# Altium schematic sheet ESP32+DAC.SchDoc
size 431 x 279 mm; SheetNumber: 3; SheetTotal: 9; ENG_APP_DATE: --/--/--; DSN_APP_DATE: --/--/--; CHK_APP_DATE: --/--/--
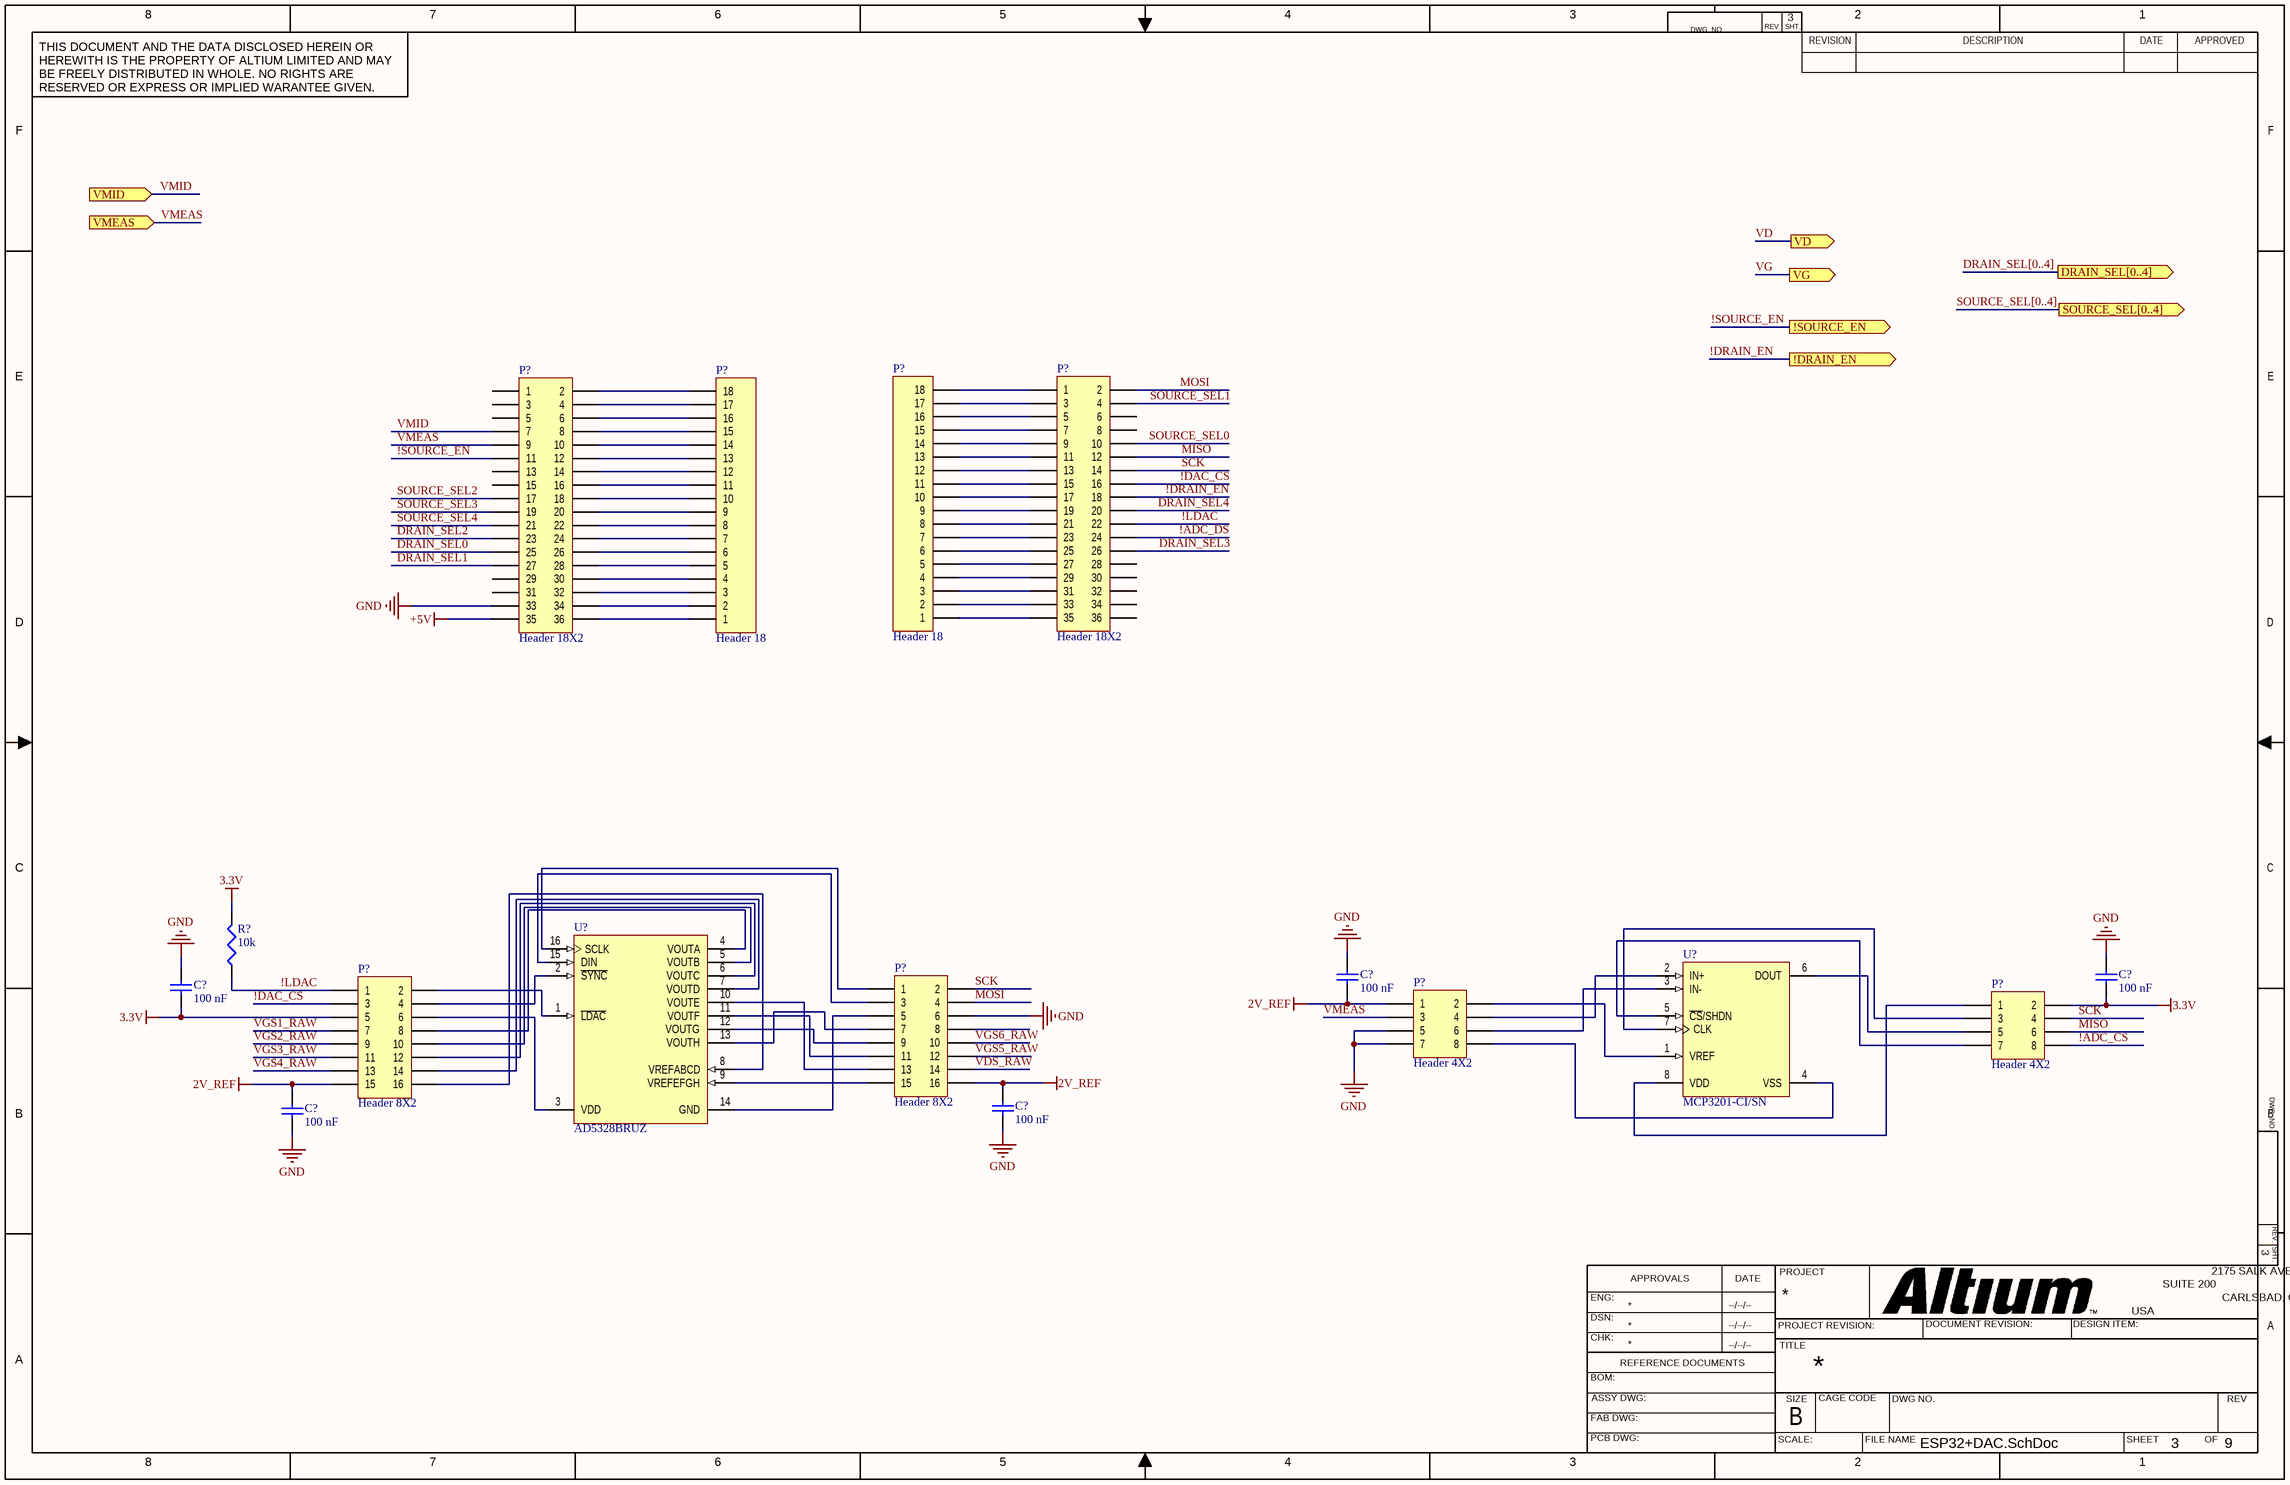
[diagram p0: ESP32+DAC.SchDoc]

## Parts
(Parts that share a designator on the sheet are numbered #1, #2 ... from top to bottom, then left to right.)
C?#1  100 nF  [1608[0603]]
C?#2  100 nF  [1608[0603]]
C?#3  100 nF  [1608[0603]]
C?#4  100 nF  [1608[0603]]
C?#5  100 nF  [1608[0603]]
P?#1  Header 18X2  [HDR2X18]
P?#2  Header 18X2  [HDR2X18]
P?#3  Header 18  [HDR1X18]
P?#4  Header 18  [HDR1X18]
P?#5  Header 8X2  [HDR2X8]
P?#6  Header 8X2  [HDR2X8]
P?#7  Header 4X2  [HDR2X4]
P?#8  Header 4X2  [HDR2X4]
R?  10k  [J1-0603]
U?#1  AD5328BRUZ  [RU-16_L]
U?#2  MCP3201-CI/SN  [SOIC-SN8_L]

## Ports
!DRAIN_EN (out), !SOURCE_EN (out), DRAIN_SEL[0..4] (out), SOURCE_SEL[0..4] (out), VD (out), VG (out), VMEAS (in), VMID (in)

## Nets
2V_REF: C?#1.2 C?#4.2 C?#5.2 P?#5.15 P?#6.16 P?#7.1
3.3V: C?#2.1 C?#3.1 P?#5.5 P?#8.2 R?.2
+5V: P?#2.35
GND: C?#1.1 C?#2.2 C?#3.2 C?#4.1 C?#5.1 P?#2.33 P?#6.6 P?#7.5 P?#7.7
!ADC_CS: P?#8.8
!ADC_DS: P?#1.24
!DAC_CS: P?#1.16 P?#5.3
!DRAIN_EN: P?#1.18 ; port !DRAIN_EN
!LDAC: P?#1.22 P?#5.1 R?.1
!SOURCE_EN: P?#2.11 ; port !SOURCE_EN
DRAIN_SEL0: P?#2.25
DRAIN_SEL1: P?#2.27
DRAIN_SEL2: P?#2.23
DRAIN_SEL3: P?#1.26
DRAIN_SEL4: P?#1.20
MISO: P?#1.12 P?#8.6
MOSI: P?#1.2 P?#6.4
SCK: P?#1.14 P?#6.2 P?#8.4
SOURCE_SEL0: P?#1.10
SOURCE_SEL1: P?#1.4
SOURCE_SEL2: P?#2.17
SOURCE_SEL3: P?#2.19
SOURCE_SEL4: P?#2.21
VD: port VD
VDS_RAW: P?#6.14
VG: port VG
VGS1_RAW: P?#5.7
VGS2_RAW: P?#5.9
VGS3_RAW: P?#5.11
VGS4_RAW: P?#5.13
VGS5_RAW: P?#6.12
VGS6_RAW: P?#6.10
VMEAS: P?#2.9 P?#7.3 ; port VMEAS
VMID: P?#2.7 ; port VMID
NetP?#1_1: P?#1.1 P?#3.18
NetP?#1_3: P?#1.3 P?#3.17
NetP?#1_5: P?#1.5 P?#3.16
NetP?#1_7: P?#1.7 P?#3.15
NetP?#1_9: P?#1.9 P?#3.14
NetP?#1_11: P?#1.11 P?#3.13
NetP?#1_13: P?#1.13 P?#3.12
NetP?#1_15: P?#1.15 P?#3.11
NetP?#1_17: P?#1.17 P?#3.10
NetP?#1_19: P?#1.19 P?#3.9
NetP?#1_21: P?#1.21 P?#3.8
NetP?#1_23: P?#1.23 P?#3.7
NetP?#1_25: P?#1.25 P?#3.6
NetP?#1_27: P?#1.27 P?#3.5
NetP?#1_29: P?#1.29 P?#3.4
NetP?#1_31: P?#1.31 P?#3.3
NetP?#1_33: P?#1.33 P?#3.2
NetP?#1_35: P?#1.35 P?#3.1
NetP?#2_2: P?#2.2 P?#4.18
NetP?#2_4: P?#2.4 P?#4.17
NetP?#2_6: P?#2.6 P?#4.16
NetP?#2_8: P?#2.8 P?#4.15
NetP?#2_10: P?#2.10 P?#4.14
NetP?#2_12: P?#2.12 P?#4.13
NetP?#2_14: P?#2.14 P?#4.12
NetP?#2_16: P?#2.16 P?#4.11
NetP?#2_18: P?#2.18 P?#4.10
NetP?#2_20: P?#2.20 P?#4.9
NetP?#2_22: P?#2.22 P?#4.8
NetP?#2_24: P?#2.24 P?#4.7
NetP?#2_26: P?#2.26 P?#4.6
NetP?#2_28: P?#2.28 P?#4.5
NetP?#2_30: P?#2.30 P?#4.4
NetP?#2_32: P?#2.32 P?#4.3
NetP?#2_34: P?#2.34 P?#4.2
NetP?#2_36: P?#2.36 P?#4.1
NetP?#5_2: P?#5.2 U?#1.1(~{LDAC})
NetP?#5_4: P?#5.4 U?#1.2(~{SYNC})
NetP?#5_6: P?#5.6 U?#1.3(VDD)
NetP?#5_8: P?#5.8 U?#1.4(VOUTA)
NetP?#5_10: P?#5.10 U?#1.5(VOUTB)
NetP?#5_12: P?#5.12 U?#1.6(VOUTC)
NetP?#5_14: P?#5.14 U?#1.7(VOUTD)
NetP?#5_16: P?#5.16 U?#1.8(VREFABCD)
NetP?#6_1: P?#6.1 U?#1.16(SCLK)
NetP?#6_3: P?#6.3 U?#1.15(DIN)
NetP?#6_5: P?#6.5 U?#1.14(GND)
NetP?#6_7: P?#6.7 U?#1.13(VOUTH)
NetP?#6_9: P?#6.9 U?#1.12(VOUTG)
NetP?#6_11: P?#6.11 U?#1.11(VOUTF)
NetP?#6_13: P?#6.13 U?#1.10(VOUTE)
NetP?#6_15: P?#6.15 U?#1.9(VREFEFGH)
NetP?#7_2: P?#7.2 U?#2.1(VREF)
NetP?#7_4: P?#7.4 U?#2.2(IN+)
NetP?#7_6: P?#7.6 U?#2.3(IN-)
NetP?#7_8: P?#7.8 U?#2.4(VSS)
NetP?#8_1: P?#8.1 U?#2.8(VDD)
NetP?#8_3: P?#8.3 U?#2.7(CLK)
NetP?#8_5: P?#8.5 U?#2.6(DOUT)
NetP?#8_7: P?#8.7 U?#2.5(~{CS}/SHDN)

Not connected (* = marked no-connect by the designer): P?#1 6 8 28 30 32 34 36; P?#2 1 3 5 13 15 29 31; P?#6 8

## Buses and harness runs
bus DRAIN_SEL[0..4] = port DRAIN_SEL[0..4]
bus SOURCE_SEL[0..4] = port SOURCE_SEL[0..4]

## Notes on the sheet
- 8
- 7
- 6
- 5
- 4
- 3
- DWG. NO.
- REV.
- SHT.
- 2
- 1
- THIS DOCUMENT AND THE DATA DISCLOSED HEREIN OR HEREWITH IS THE PROPERTY OF ALTIUM LIMITED AND MAY BE FREELY DISTRIBUTED IN WHOLE. NO RIGHTS ARE RESERVED OR EXPRESS OR IMPLIED WARANTEE GIVEN.
- REVISION
- DESCRIPTION
- DATE
- APPROVED
- F
- E
- D
- C
- B
- ENG:
- APPROVALS
- PROJECT
- SUITE 200
- 2175 SALK AVENUE
- CARLSBAD, CA 92008
- A
- DSN:
- CHK:
- REFERENCE DOCUMENTS
- PROJECT REVISION:
- TITLE
- DOCUMENT REVISION:
- DESIGN ITEM:
- USA
- BOM:
- FAB DWG:
- PCB DWG:
- ASSY DWG:
- SCALE:
- SIZE
- CAGE CODE
- FILE NAME
- DWG NO.
- SHEET
- OF
- REV

## Library data of the parts
C?#1-C?#5 = Cap Semi: Published: 8-Jun-2000; LatestRevisionDate: 29-May-2009; LatestRevisionNote: IPC-7351 Footprint Added.; PackageReference: C1206; Publisher: Altium Limited; PackageDescription: Chip Capacitor
P?#1 P?#2 = Header 18X2: Header, 18-Pin, Dual row; LatestRevisionDate: 17-Jul-2002; LatestRevisionNote: Re-released for DXP Platform.; Publisher: Altium Limited
P?#3 P?#4 = Header 18: Header, 18-Pin; LatestRevisionDate: 17-Jul-2002; LatestRevisionNote: Re-released for DXP Platform.; Publisher: Altium Limited
P?#5 P?#6 = Header 8X2: Header, 8-Pin, Dual row; LatestRevisionDate: 17-Jul-2002; LatestRevisionNote: Re-released for DXP Platform.; Publisher: Altium Limited
P?#7 P?#8 = Header 4X2: Header, 4-Pin, Dual row; LatestRevisionDate: 17-Jul-2002; LatestRevisionNote: Re-released for DXP Platform.; Publisher: Altium Limited
R? = Res3: Resistor; Published: 8-Jun-2000; LatestRevisionDate: 29-May-2009; LatestRevisionNote: IPC-7351 Footprint Added.; PackageReference: J1-0603; Publisher: Altium Limited; PackageDescription: Chip Resistor
U?#1 = CMP-0318-02011-2: Octal 12-Bit Voltage Output Digital-to-Analog Converter, 2.5 to 5.5 V, -40 to +125 degC, RU-16, Pb-Free, Tube; Generic Part Number: AD5328; Manufacturer: Analog Devices; Settling Time: 6Âµs; Op Pwr Diss: 5mW; Max V+: 5.5V; Single Supply: Yes; Resolution (Bits): 12; # DAC Outputs: 8; PackageDescription: 16-Lead Thin Shrink Small Outline Package [TSSOP]; ComponentLink3URL: http://www.analog.com/static/imported-files/packages/36244347913743854010197452789RU16.pdf; DatasheetVersion: Rev.F; ComponentLink2Description: Datasheet; Mounting Technology: Surface Mount; ComponentLink4URL: http://www.analog.com/en/digital-to-analog-converters/da-converters/ad5328/products/product.html; RevisionNote: Component URL fixed; PackageVersion: Nov-2002; PackageReference: RU-16; ComponentLink1URL: http://www.analog.com/en/index.html; ComponentLink4Description: Product URL; ComponentLink1Description: Manufacturer URL; Packing: Tube; ComponentLink2URL: http://www.analog.com/static/imported-files/data_sheets/AD5308_5318_5328.pdf; RoHS: Y; ComponentLink3Description: Package Specification; Code_JEDEC: MO-153-AB; PartNumber: AD5328BRUZ
U?#2 = CMP-0188-00469-2: 2.7V 12-Bit A/D Converter with SPI Serial Interface, 8-Pin SOIC 150mil, C Performance Grade, Industrial Temperature; ComponentLink1URL: http://www.microchip.com/; DatasheetVersion: revF, Aug-2011; RevisionNote: URLs added. DatasheetVersion updated.; Code_IPC: SOIC127P600-8; ComponentLink3URL: http://www.microchip.com/stellent/groups/techpub_sg/documents/packagingspec/en012702.pdf; ComponentLink3Description: Package Specification; ComponentLink2URL: http://ww1.microchip.com/downloads/en/DeviceDoc/21290F.pdf; PackageReference: SOIC-SN8; ComponentLink1Description: Manufacturer URL; ComponentLink2Description: Datasheet; PackageVersion: revBB, Aug-2009; Code_JEDEC: MS-012; PackageDescription: 8-Lead Plastic Small Outline (SN) - Narrow, 3.90mm Body [SOIC]